# EAGLE design nRF_touch (EAGLE 6.6.0)

## Sheet 1 of 4: MCU
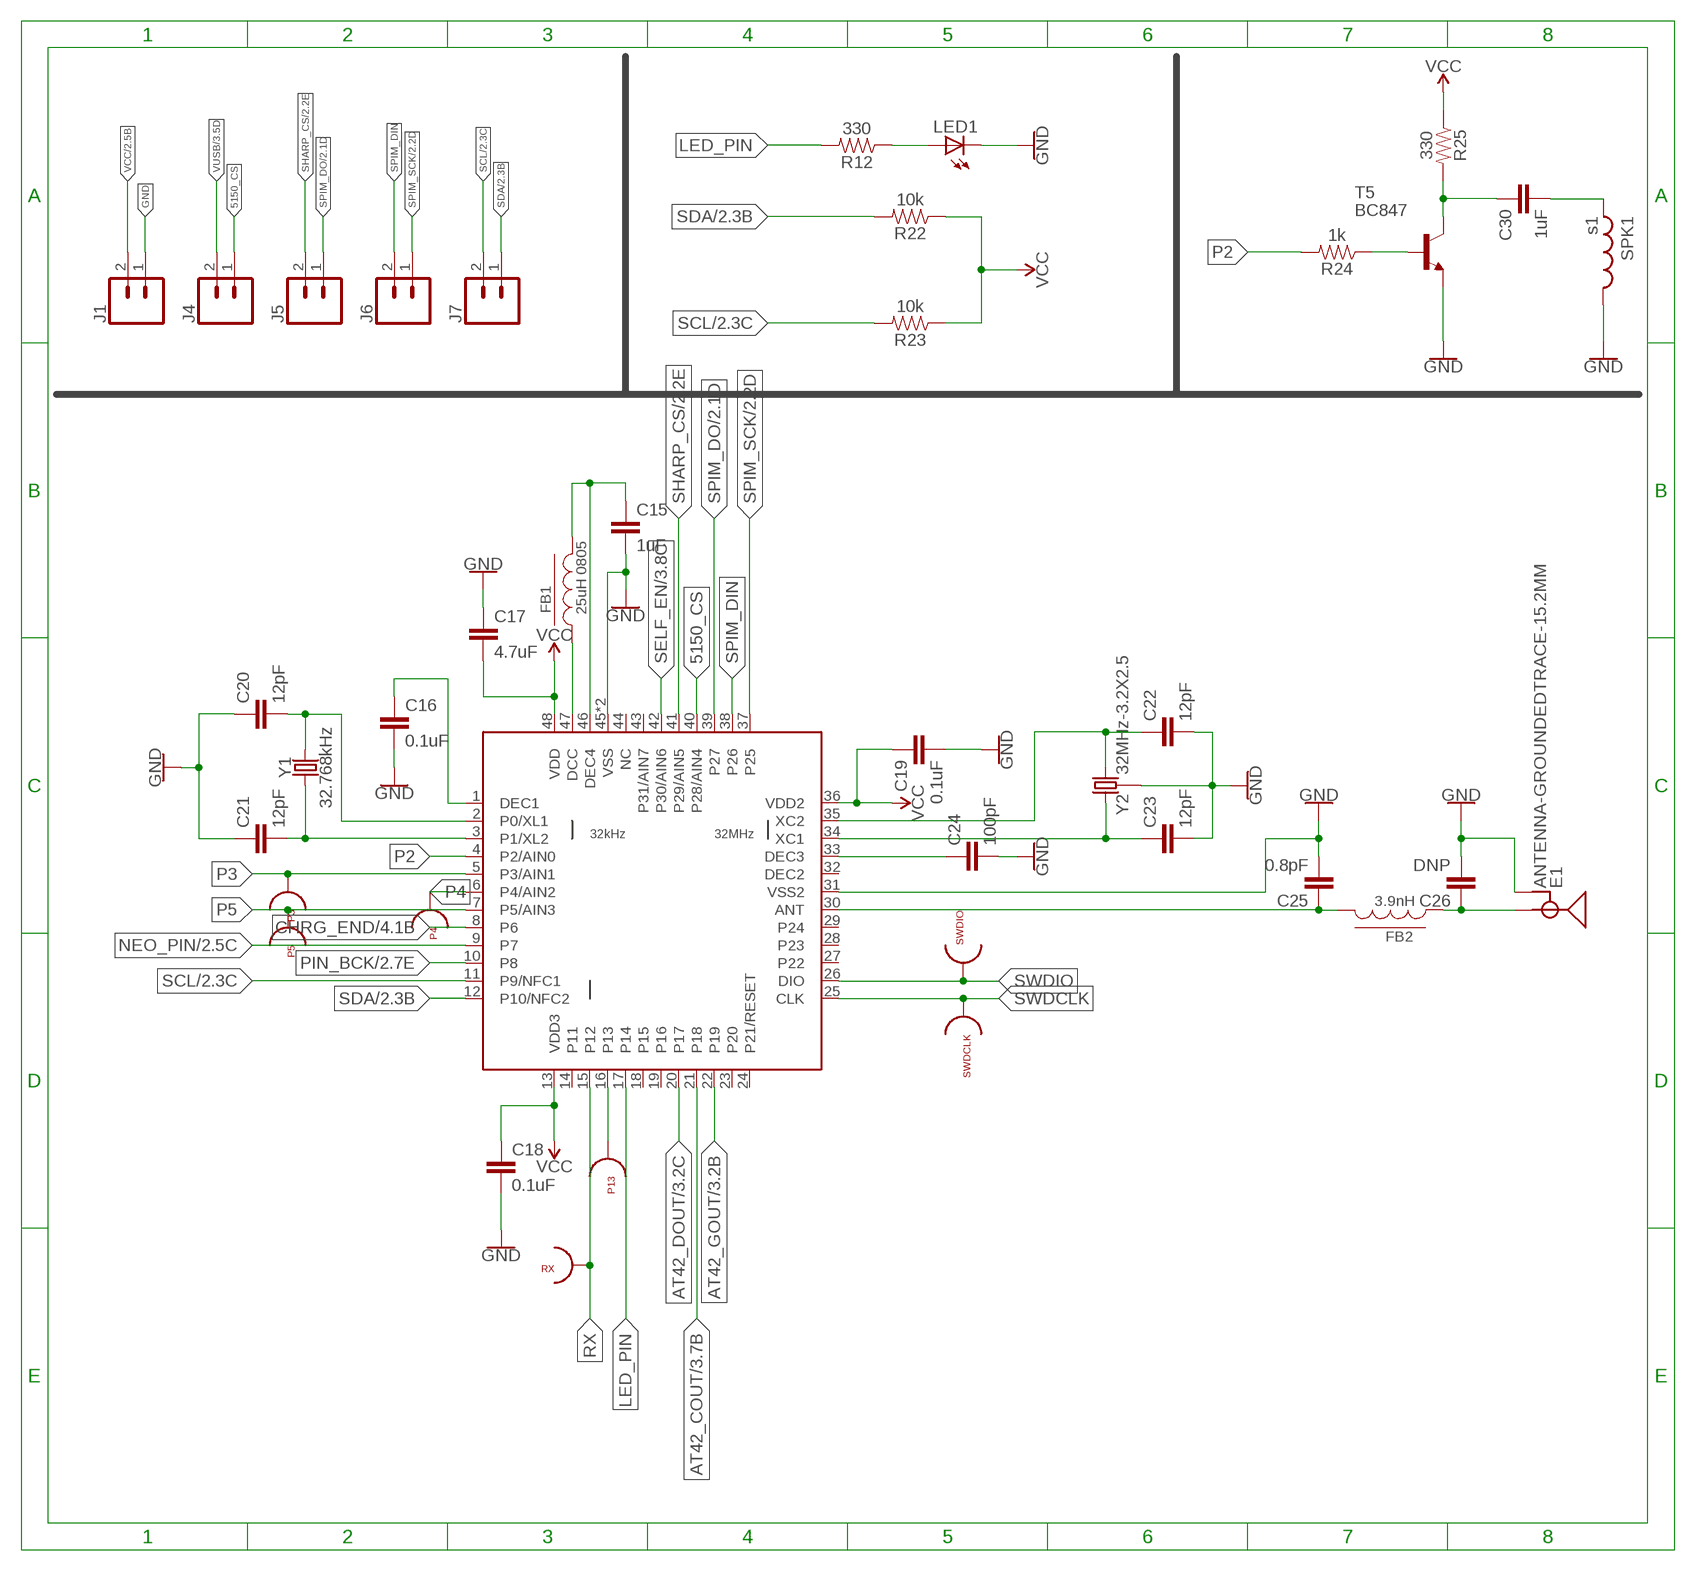
[diagram p0: schematic, sheet 1]

### Parts
C15  1uF  4.7UF0603  [0603]
C16  0.1uF  4.7UF0603  [0603]
C17  4.7uF  4.7UF0603  [0603]
C18  0.1uF  4.7UF0603  [0603]
C19  0.1uF  4.7UF0603  [0603]
C20  12pF  4.7UF0603  [0603]
C21  12pF  4.7UF0603  [0603]
C22  12pF  4.7UF0603  [0603]
C23  12pF  4.7UF0603  [0603]
C24  100pF  4.7UF0603  [0603]
C25  0.8pF  4.7UF0603  [0603]
C26  DNP  4.7UF0603  [0603]
C30  1uF  4.7UF0603  [0603]
E1  ANTENNA-GROUNDEDTRACE-15.2MM  [TRACE_ANTENNA_2.4GHZ_15.2MM]
FB1  25uH 0805  FB_0805  [L0805]
FB2  3.9nH  FB_0805  [L0805]
J1  CONN_02  [1X02]
J4  CONN_02  [1X02]
J5  CONN_02  [1X02]
J6  CONN_02  [1X02]
J7  CONN_02  [1X02]
LED1  LEDCHIPLED_1206  [CHIPLED_1206]
P3  p3  TESTPOINT_22  [TESTPOINT_22]
P4  TESTPOINT_22  [TESTPOINT_22]
P5  TESTPOINT_22  [TESTPOINT_22]
P13  TESTPOINT_22  [TESTPOINT_22]
R12  330  4.7KOHM-0603-1/10W-1%  [0603]
R22  10k  4.7KOHM-0603-1/10W-1%  [0603]
R23  10k  4.7KOHM-0603-1/10W-1%  [0603]
R24  1k  4.7KOHM-0603-1/10W-1%  [0603]
R25  330  4.7KOHM-0603-1/10W-1%  [0603]
RX  TESTPOINT_22  [TESTPOINT_22]
SPK1  s1  MDMK2020T4R7MM  [IND-2020]
SWDCLK  TESTPOINT_22  [TESTPOINT_22]
SWDIO  TESTPOINT_22  [TESTPOINT_22]
T5  BC847  [SOT23]
U$6  NRF52832NRF52832-QFAA  [QFN48]
Y1  32.768kHz  CRYSTAL-32.768KHZSMD-3.2X1.5  [CRYSTAL-SMD-3.2X1.5MM]
Y2  32MHz-3.2X2.5  CRYSTAL-GROUNDEDSMD-5X3.2  [CRYSTAL-SMD-5X3.2-4PAD]

### Nets
5150_CS: J4.1 U$6.40(P28/AIN4)
AT42_COUT: U$6.21(P18) ; also sheet 3
AT42_DOUT [touch]: U$6.20(P17) ; also sheet 3
AT42_GOUT [touch]: U$6.22(P19) ; also sheet 3
CHRG_END: U$6.8(P6) ; also sheet 4
GND [power]: C15.2 C16.2 C17.1 C18.2 C19.2 C20.1 C21.1 C22.2 C23.2 C24.2 C25.2 C26.2 E1.GND J1.1 LED1.C SPK1.P$2 T5.2(E) U$6.31(VSS2) U$6.45(VSS) U$6.GND(VSS) Y2.2 Y2.4 ; also sheet 2,3,4
LED_PIN: R12.2 U$6.17(P14)
N$2 [power]: LED1.A R12.1
N$10: C30.1 R25.2 T5.3(C)
N$15: C24.1 U$6.33(DEC3)
N$17: C15.1 FB1.2 U$6.46(DEC4)
N$18: C25.1 FB2.2 U$6.30(ANT)
N$19: FB1.1 U$6.47(DCC)
N$20: C16.1 U$6.1(DEC1)
N$21: C26.1 E1.ANT(SIGNAL) FB2.1
N$24: C20.2 U$6.2(P0/XL1) Y1.P$2
N$25: C21.2 U$6.3(P1/XL2) Y1.P$1
N$27: C22.1 U$6.35(XC2) Y2.1
N$28: C23.1 U$6.34(XC1) Y2.3
N$29: C30.2 SPK1.P$1
N$30: R24.1 T5.1(B)
NEO_PIN: U$6.9(P7) ; also sheet 2
P2: R24.2 U$6.4(P2/AIN0)
P3: P3.P$1 U$6.5(P3/AIN1)
P4: P4.P$1 U$6.6(P4/AIN2)
P5: P5.P$1 U$6.7(P5/AIN3)
P13: P13.P$1 U$6.16(P13)
PIN_BCK: U$6.10(P8) ; also sheet 2
RX: RX.P$1 U$6.15(P12)
SCL: J7.2 R23.2 U$6.11(P9/NFC1) ; also sheet 2,4
SDA: J7.1 R22.2 U$6.12(P10/NFC2) ; also sheet 2,4
SELF_EN: U$6.42(P30/AIN6) ; also sheet 3
SHARP_CS: J5.2 U$6.41(P29/AIN5) ; also sheet 2
SPIM_DIN: J6.2 U$6.38(P26)
SPIM_DO: J5.1 U$6.39(P27) ; also sheet 2
SPIM_SCK: J6.1 U$6.37(P25) ; also sheet 2
SWDCLK: SWDCLK.P$1 U$6.25(CLK)
SWDIO: SWDIO.P$1 U$6.26(DIO)
VCC [power]: C17.2 C18.1 C19.1 J1.2 R22.1 R23.1 R25.1 U$6.13(VDD3) U$6.36(VDD2) U$6.48(VDD) ; also sheet 2,3,4
VUSB [power]: J4.2 ; also sheet 3,4
Unconnected: U$6.14(P11) U$6.18(P15) U$6.19(P16) U$6.23(P20) U$6.24(P21/RESET) U$6.27(P22) U$6.28(P23) U$6.29(P24) U$6.32(DEC2) U$6.43(P31/AIN7) U$6.44(NC)

## Sheet 2 of 4: PERIPH
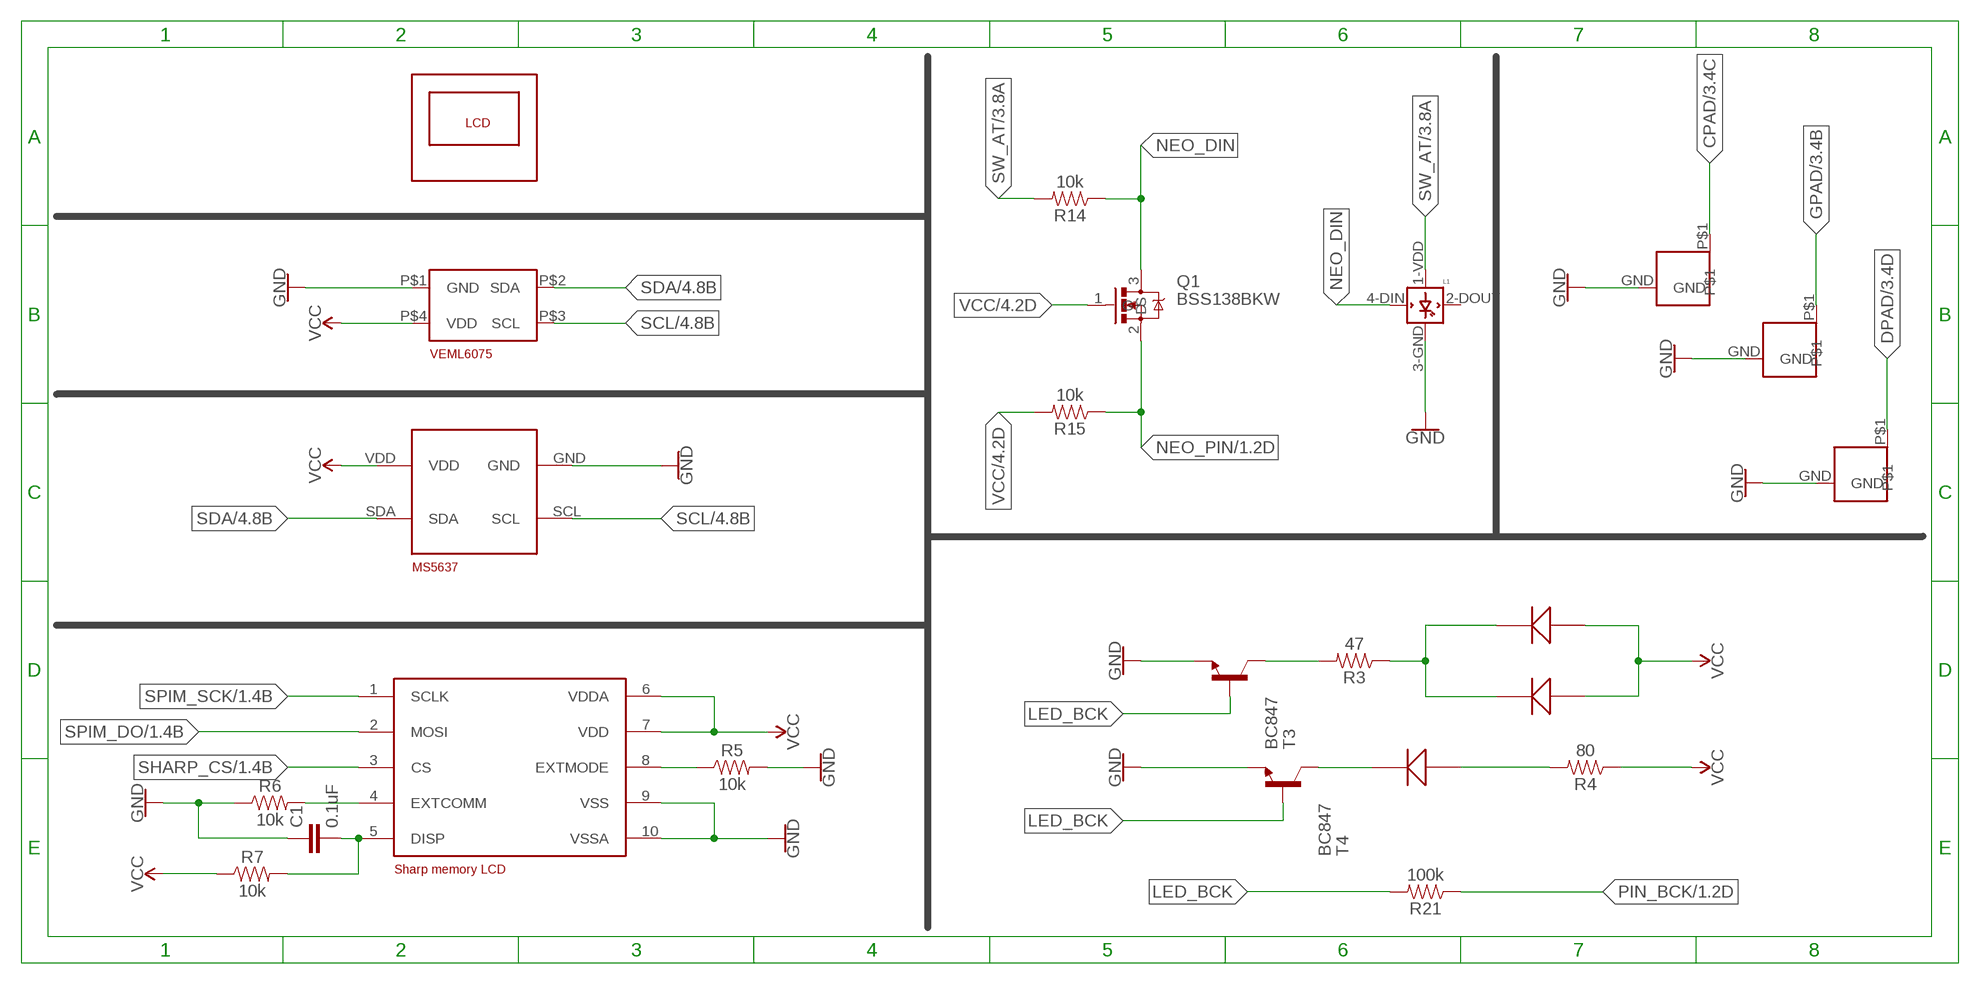
[diagram p1: schematic, sheet 2]

### Parts
C1  0.1uF  0.1UF-0603-25V-(+80/-20%)  [0603]
L1  WS2812B  [WS2812B]
MS5637  MS5637  [MS5637]
Q1  BSS138BKW  [SOT65P210X110-3N]
R3  47  4.7KOHM-0603-1/10W-1%  [0603]
R4  80  4.7KOHM-0603-1/10W-1%  [0603]
R5  10k  4.7KOHM-0603-1/10W-1%  [0603]
R6  10k  4.7KOHM-0603-1/10W-1%  [0603]
R7  10k  4.7KOHM-0603-1/10W-1%  [0603]
R14  10k  4.7KOHM-0603-1/10W-1%  [0603]
R15  10k  4.7KOHM-0603-1/10W-1%  [0603]
R21  100k  4.7KOHM-0603-1/10W-1%  [0603]
S1  L_BUTTON  BUTTON  [BUTTON]
S2  BUTTON  [BUTTON]
S3  L_BUTTON  BUTTON  [BUTTON]
T3  BC847  [SOT23]
T4  BC847  [SOT23]
U$1  KPA-2106SECK  [KPA-2106SECK]
U$2  VEML6075  [VEML6075]
U$4  SHARP27  [SHARP27]
U$5  SHARP27_FOOTPRINT  [LCD27]
U$7  KPA-2106SECK  [KPA-2106SECK]
U$8  KPA-2106SECK  [KPA-2106SECK]

### Nets
CPAD [touch]: S2.P$1 ; also sheet 3
DISP: C1.2 R7.2 U$4.5(DISP)
DPAD [touch]: S1.P$1 ; also sheet 3
EXTCOMM: R6.2 U$4.4(EXTCOMM)
EXTMODE: R5.1 U$4.8(EXTMODE)
GND [power]: C1.1 L1.3-GND(GND) MS5637.GND R5.2 R6.1 S1.GND S2.GND S3.GND T3.2(E) T4.2(E) U$2.P$1(GND) U$4.9(VSS) U$4.10(VSSA) ; also sheet 1,3,4
GPAD [touch]: S3.P$1 ; also sheet 3
LED_BCK: R21.2 T3.1(B) T4.1(B)
N$11: R4.2 U$8.P$2
N$13: R3.1 U$1.P$1 U$7.P$1
N$22: T4.3(C) U$8.P$1
N$23: R3.2 T3.3(C)
NEO_DIN: L1.4-DIN(DIN) Q1.3(D) R14.1
NEO_PIN: Q1.2(S) R15.1 ; also sheet 1
PIN_BCK: R21.1 ; also sheet 1
SCL: MS5637.SCL U$2.P$3(SCL) ; also sheet 1,4
SDA: MS5637.SDA U$2.P$2(SDA) ; also sheet 1,4
SHARP_CS: U$4.3(CS) ; also sheet 1
SPIM_DO: U$4.2(MOSI) ; also sheet 1
SPIM_SCK: U$4.1(SCLK) ; also sheet 1
SW_AT: L1.1-VDD(VDD) R14.2 ; also sheet 3
VCC [power]: MS5637.VDD Q1.1(G) R4.1 R7.1 R15.2 U$1.P$2 U$2.P$4(VDD) U$4.6(VDDA) U$4.7(VDD) U$7.P$2 ; also sheet 1,3,4
Unconnected: L1.2-DOUT(DOUT)

## Sheet 3 of 4: PSwitch
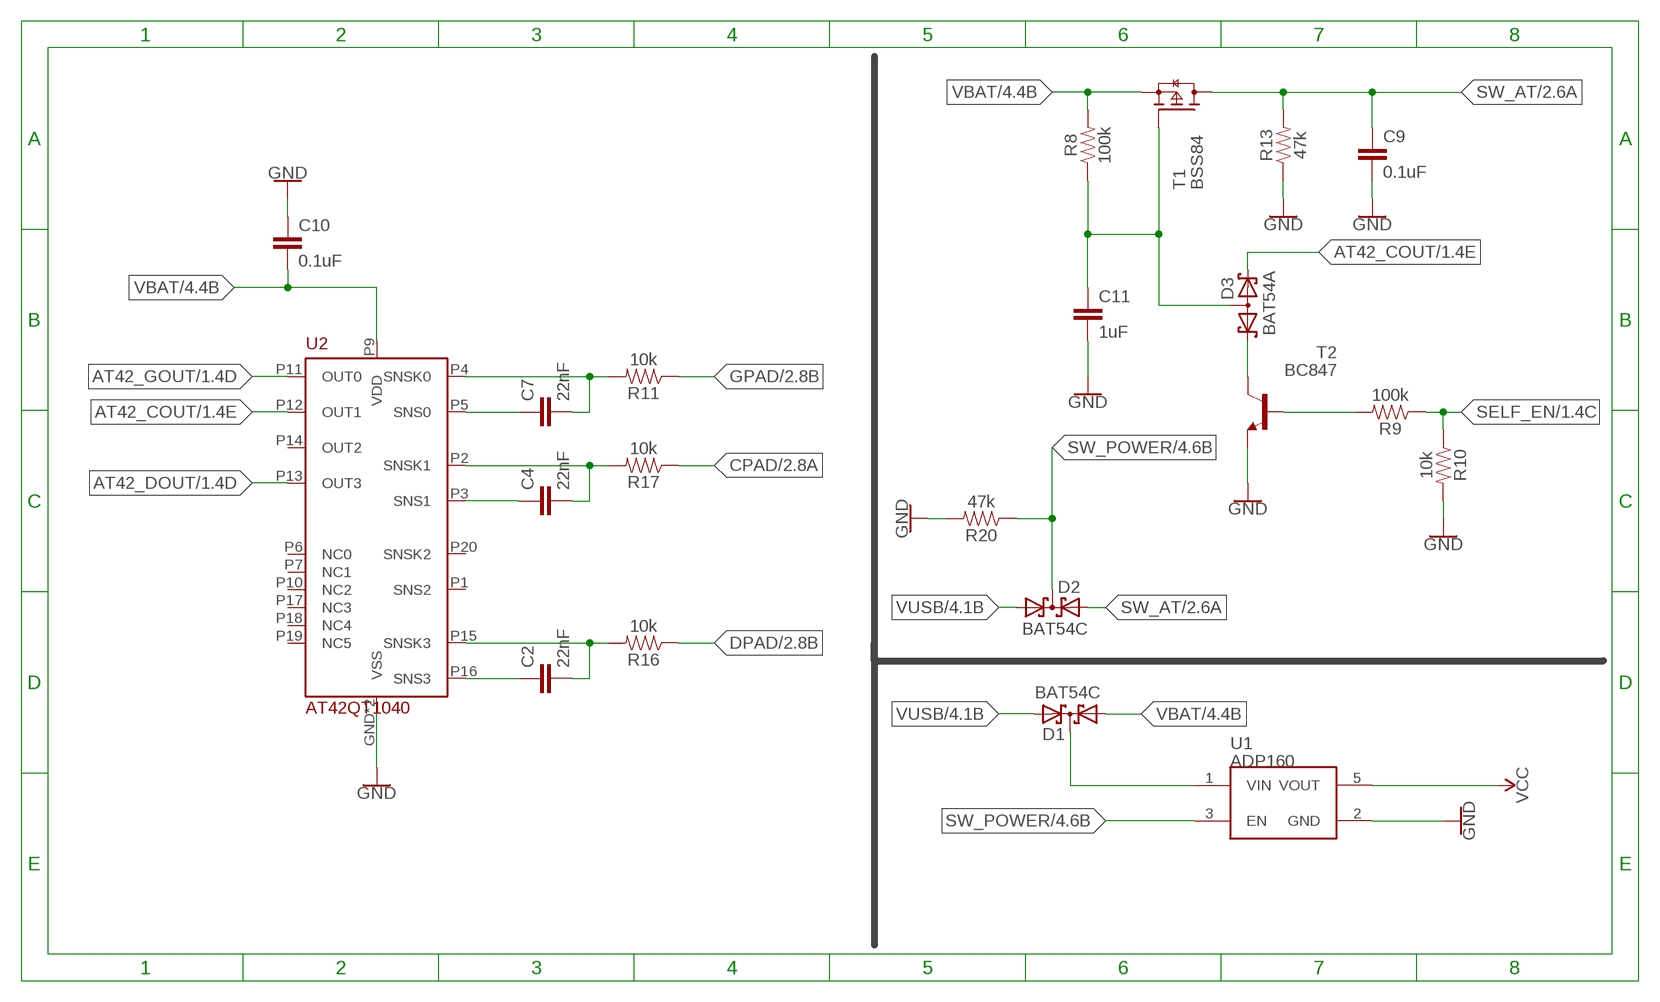
[diagram p2: schematic, sheet 3]

### Parts
C2  22nF  0.1UF-0603-25V-5%  [0603]
C4  22nF  0.1UF-0603-25V-5%  [0603]
C7  22nF  0.1UF-0603-25V-5%  [0603]
C9  0.1uF  0.1UF-0603-25V-5%  [0603]
C10  0.1uF  0.1UF-0603-25V-5%  [0603]
C11  1uF  0.1UF-0603-25V-5%  [0603]
D1  BAT54C  BAT754C  [SOT23]
D2  BAT54C  BAT754C  [SOT23]
D3  BAT54A  BAT754A  [SOT23]
R8  100k  4.7KOHM-0603-1/10W-1%  [0603]
R9  100k  4.7KOHM-0603-1/10W-1%  [0603]
R10  10k  4.7KOHM-0603-1/10W-1%  [0603]
R11  10k  4.7KOHM-0603-1/10W-1%  [0603]
R13  47k  4.7KOHM-0603-1/10W-1%  [0603]
R16  10k  4.7KOHM-0603-1/10W-1%  [0603]
R17  10k  4.7KOHM-0603-1/10W-1%  [0603]
R20  47k  4.7KOHM-0603-1/10W-1%  [0603]
T1  BSS84  [SOT23]
T2  BC847  [SOT23]
U1  ADP160  [SOT23-5]
U2  AT42QT1040  [VQFN20]

### Nets
AT42_COUT: D3.2(K2) U2.P12(OUT1) ; also sheet 1
AT42_DOUT [touch]: U2.P13(OUT3) ; also sheet 1
AT42_GOUT [touch]: U2.P11(OUT0) ; also sheet 1
CPAD [touch]: R17.1 ; also sheet 2
DPAD [touch]: R16.1 ; also sheet 2
GND [power]: C9.2 C10.1 C11.2 R10.2 R13.1 R20.2 T2.2(E) U1.2(GND) U2.GND(VSS) U2.P8(VSS) ; also sheet 1,2,4
GPAD [touch]: R11.1 ; also sheet 2
LDO_VIN [power]: D1.3(K1K2) U1.1(VIN)
N$1: R9.2 T2.1(B)
N$3: C2.2 R16.2 U2.P15(SNSK3)
N$4: C2.1 U2.P16(SNS3)
N$5: C4.2 R17.2 U2.P2(SNSK1)
N$6: C7.2 R11.2 U2.P4(SNSK0)
N$7: C7.1 U2.P5(SNS0)
N$8: C11.1 D3.3(A1A2) R8.1 T1.1(G)
N$9: C4.1 U2.P3(SNS1)
SELF_EN: R9.1 R10.1 ; also sheet 1
SW_AT: C9.1 D2.2(A2) R13.2 T1.3(D) ; also sheet 2
SW_POWER: D2.3(K1K2) R20.1 U1.3(EN) ; also sheet 4
TRANS: D3.1(K1) T2.3(C)
VBAT [power]: C10.2 D1.1(A1) R8.2 T1.2(S) U2.P9(VDD) ; also sheet 4
VCC [power]: U1.5(VOUT) ; also sheet 1,2,4
VUSB [power]: D1.2(A2) D2.1(A1) ; also sheet 1,4
Unconnected: U2.P1(SNS2) U2.P6(NC0) U2.P7(NC1) U2.P10(NC2) U2.P14(OUT2) U2.P17(NC3) U2.P18(NC4) U2.P19(NC5) U2.P20(SNSK2)

## Sheet 4 of 4: Power
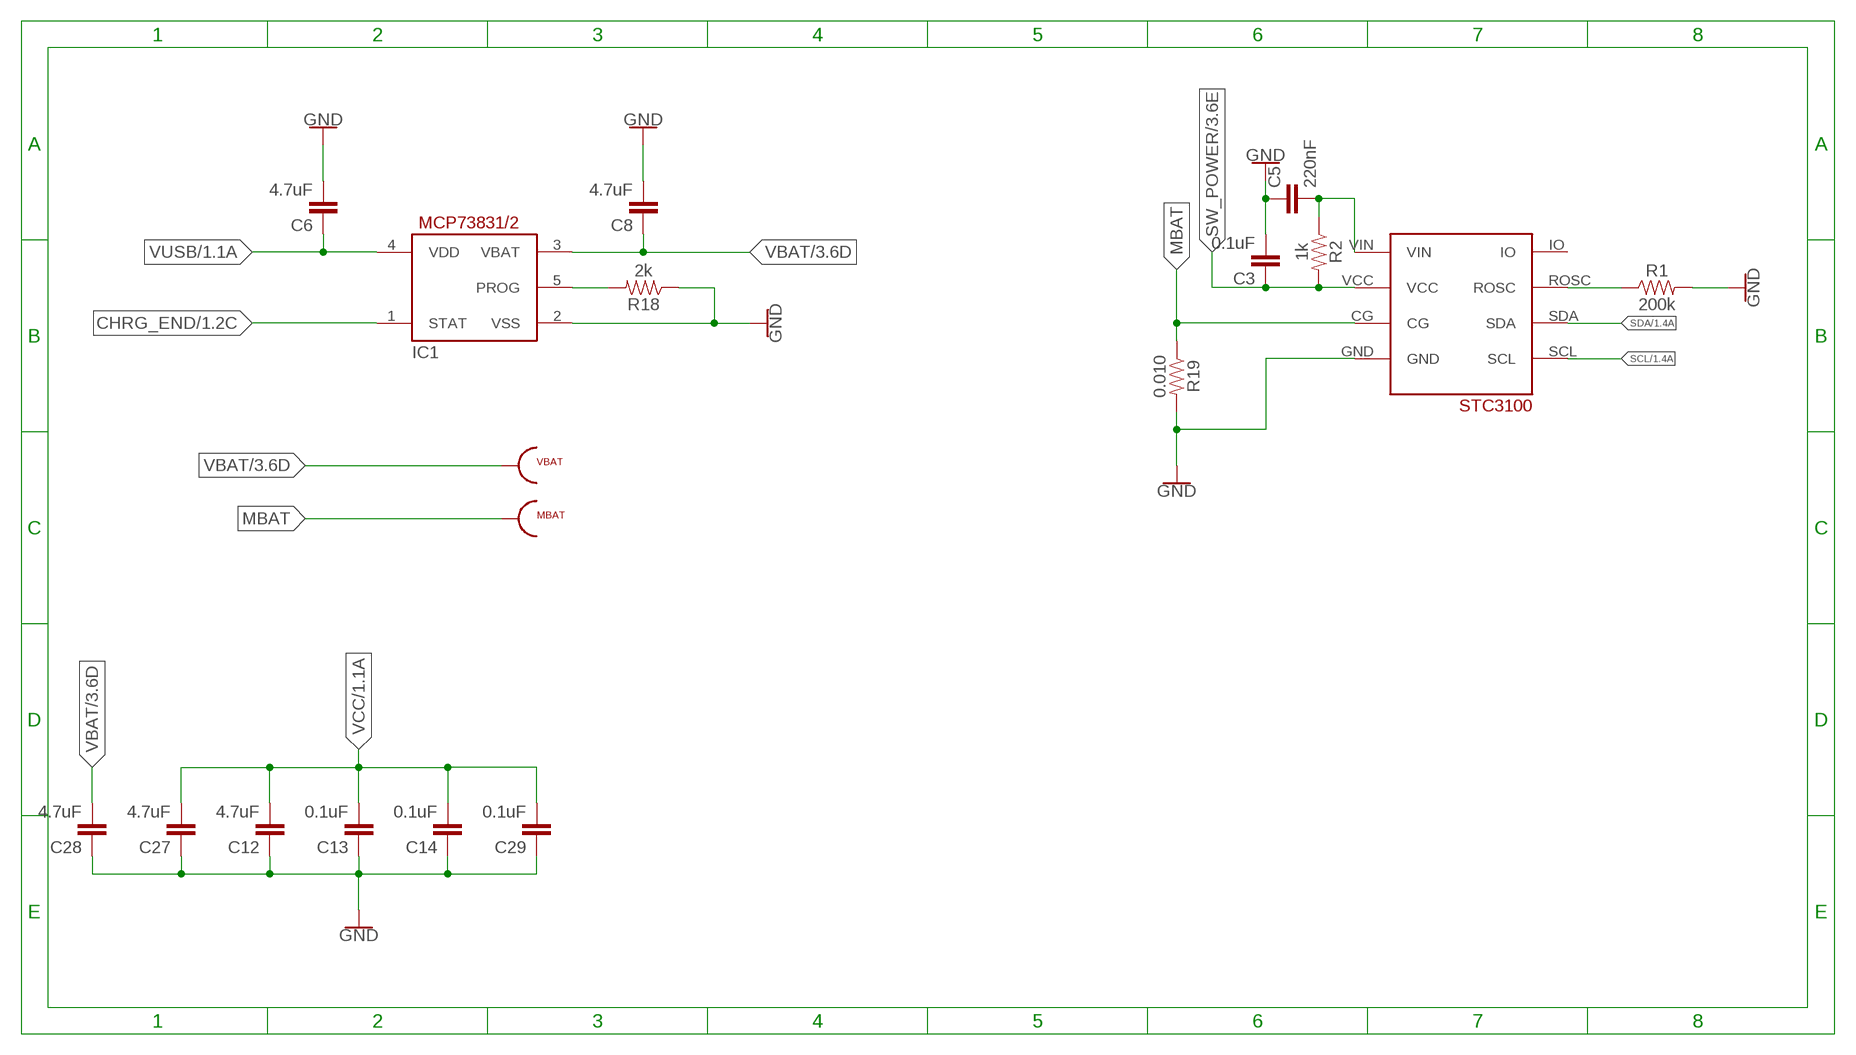
[diagram p3: schematic, sheet 4]

### Parts
C3  0.1uF  0.1UF-0603-25V-(+80/-20%)  [0603]
C5  220nF  0.1UF-0603-25V-(+80/-20%)  [0603]
C6  4.7uF  0.1UF-0603-25V-(+80/-20%)  [0603]
C8  4.7uF  0.1UF-0603-25V-(+80/-20%)  [0603]
C12  4.7uF  0.1UF-0603-25V-(+80/-20%)  [0603]
C13  0.1uF  0.1UF-0603-25V-(+80/-20%)  [0603]
C14  0.1uF  0.1UF-0603-25V-(+80/-20%)  [0603]
C27  4.7uF  0.1UF-0603-25V-(+80/-20%)  [0603]
C28  4.7uF  0.1UF-0603-25V-(+80/-20%)  [0603]
C29  0.1uF  0.1UF-0603-25V-(+80/-20%)  [0603]
IC1  MCP73831/OT  [SOT23-5L]
MBAT  TESTPOINT_22  [TESTPOINT_22]
R1  200k  4.7KOHM-0603-1/10W-1%  [0603]
R2  1k  4.7KOHM-0603-1/10W-1%  [0603]
R18  2k  4.7KOHM-0603-1/10W-1%  [0603]
R19  0.010  4.7KOHM-0603-1/10W-1%  [0603]
U$3  STC3100  [STC3100]
VBAT  TESTPOINT_22  [TESTPOINT_22]

### Nets
CHRG_END: IC1.1(STAT) ; also sheet 1
GND [power]: C3.2 C5.1 C6.2 C8.2 C12.1 C13.1 C14.1 C27.1 C28.1 C29.1 IC1.2(VSS) R1.2 R18.1 R19.2 U$3.GND ; also sheet 1,2,3
MBAT: MBAT.P$1 R19.1 U$3.CG
N$12: C5.2 R2.1 U$3.VIN
N$14: IC1.5(PROG) R18.2
N$16: R1.1 U$3.ROSC
SCL: U$3.SCL ; also sheet 1,2
SDA: U$3.SDA ; also sheet 1,2
SW_POWER: C3.1 R2.2 U$3.VCC ; also sheet 3
VBAT [power]: C8.1 C28.2 IC1.3(VBAT) VBAT.P$1 ; also sheet 3
VCC [power]: C12.2 C13.2 C14.2 C27.2 C29.2 ; also sheet 1,2,3
VUSB [power]: C6.1 IC1.4(VDD) ; also sheet 1,3
Unconnected: U$3.IO

## Library data of the parts
C1 C3 C13 C14 C29 = SparkFun-Capacitors:0.1UF: 0.1µF ceramic capacitors A capacitor is a passive two-terminal electrical component used to store electrical energy temporarily in an electric field.; PROD_ID: CAP-00810
C2 C4 C7 C11 = SparkFun-Capacitors:0.1UF: 0.1µF ceramic capacitors A capacitor is a passive two-terminal electrical component used to store electrical energy temporarily in an electric field.; PROD_ID: CAP-08604; VALUE: 0.1uF
C5 C6 C8 C12 C27 C28 = SparkFun-Capacitors:0.1UF: 0.1µF ceramic capacitors A capacitor is a passive two-terminal electrical component used to store electrical energy temporarily in an electric field.; PROD_ID: CAP-00810; VALUE: 0.1uF
C9 C10 = SparkFun-Capacitors:0.1UF: 0.1µF ceramic capacitors A capacitor is a passive two-terminal electrical component used to store electrical energy temporarily in an electric field.; PROD_ID: CAP-08604
C15 C16 C18-C26 C30 = SparkFun-Capacitors:4.7UF: 4.7µF ceramic capacitors A capacitor is a passive two-terminal electrical component used to store electrical energy temporarily in an electric field.; PROD_ID: CAP-08280; VALUE: 4.7uF
C17 = SparkFun-Capacitors:4.7UF: 4.7µF ceramic capacitors A capacitor is a passive two-terminal electrical component used to store electrical energy temporarily in an electric field.; PROD_ID: CAP-08280
D1 D2 = nxp_60:BAT754C: Schottky barrier (double) diodes Planar Schottky barrier diodes encapsulated in a SOT23 small plastic SMD package. Low forward voltage selection of the BAT54 series. Single diodes and double diodes with different pinning are available. AAL Eindhoven MK
D3 = nxp_60:BAT754A: Schottky barrier (double) diodes Planar Schottky barrier diodes encapsulated in a SOT23 small plastic SMD package. Low forward voltage selection of the BAT54 series. Single diodes and double diodes with different pinning are available. AAL Eindhoven MK
E1 = SparkFun-RF:ANTENNA-GROUNDED: Antenna w/ Ground Connection 2.4GHz antennae with signal and ground terminals. TRACE_ANTENNA_2.4GHZ_15.2MM - Meander Trace antenna 15.2 x 5.7mm footprint Based on layout from TI app note AN043 <http://www.ti.com/lit/an/swra117d/swra117d.pdf>. TRACE_ANTENNA_2.4GHZ_25.7MM - Inverted F trace antenna 25.7 x 7.5 mm footprint. Based on layout from TI design note DN0007 <http://www.ti.com/lit/an/swru120b/swru120b.pdf>.
FB1 FB2 = ferrite_beads:FB_0805
IC1 = adafruit:MCP73831: MCP73831/2 Miniature Single-Cell, Fully Integrated Li-Ion, Li-Polymer Charge Management Controllers. Nice and small simple lipoly charge controller, with adjustable current and status output (LED) http://www.ladyada.net/library/pcb/eaglelibrary.html
J1 J4-J7 = SparkFun-Connectors:CONN_02: Multi connection point. Often used as Generic Header-pin footprint for 0.1 inch spaced/style header connections On any of the 0.1 inch spaced packages, you can populate with these: Break Away Headers - Straight <https://www.sparkfun.com/products/116> (PRT-00116) Break Away Male Headers - Right Angle <https://www.sparkfun.com/products/553> (PRT-00553) Female Headers <https://www.sparkfun.com/products/115> (PRT-00115) Break Away Headers - Machine Pin <https://www.sparkfun.com/products/117> (PRT-00117) Break Away Female Headers - Swiss Machine Pin <https://www.sparkfun.com/products/743> (PRT-00743) For SCREWTERMINALS and SPRING TERMINALS visit here: Screw Terimnals on SparkFun.com <https://www.sparkfun.com/search/results?term=Screw+Terminals> (5mm/3.5mm/2.54mm spacing) This device is also useful as a general connection point to wire up your design to another part of your project. Our various solder wires solder well into these plated through hole pads. Hook-Up Wire - Assortment (Stranded, 22 AWG) <https://www.sparkfun.com/products/11375> (PRT-11375) Hook-Up Wire - Assortment (Solid Core, 22 AWG) <https://www.sparkfun.com/products/11367> (PRT-11367) View the entire wire category on our website here <https://www.sparkfun.com/categories/141> Special notes: Molex polarized connector foot print use with: PRT-08233 with associated crimp pins and housings. 2.54_SCREWTERM for use with PRT-10571. 3.5mm Screw Terminal footprints for PRT-08084 5mm Screw Terminal footprints for use with PRT-08432
L1 = adafruit:WS2812B
LED1 = adafruit:LED: LED OSRAM: - CHIPLED LG R971, LG N971, LY N971, LG Q971, LY Q971, LO R971, LY R971 LH N974, LH R974 LS Q976, LO Q976, LY Q976 LO Q996 - Hyper CHIPLED LW Q18S LB Q993, LB Q99A, LB R99A - SideLED LS A670, LO A670, LY A670, LG A670, LP A670 LB A673, LV A673, LT A673, LW A673 LH A674 LY A675 LS A676, LA A676, LO A676, LY A676, LW A676 LS A679, LY A679, LG A679 - Hyper Micro SIDELED® LS Y876, LA Y876, LO Y876, LY Y876 LT Y87S - SmartLED LW L88C, LW L88S LB L89C, LB L89S, LG L890 LS L89K, LO L89K, LY L89K LS L896, LA L896, LO L896, LY L896 - TOPLED LS T670, LO T670, LY T670, LG T670, LP T670 LSG T670, LSP T670, LSY T670, LOP T670, LYG T670 LG T671, LOG T671, LSG T671 LB T673, LV T673, LT T673, LW T673 LH T674 LS T676, LA T676, LO T676, LY T676, LB T676, LH T676, LSB T676, LW T676 LB T67C, LV T67C, LT T67C, LS T67K, LO T67K, LY T67K, LW E67C LS E67B, LA E67B, LO E67B, LY E67B, LB E67C, LV E67C, LT E67C LW T67C LS T679, LY T679, LG T679 LS T770, LO T770, LY T770, LG T770, LP T770 LB T773, LV T773, LT T773, LW T773 LH T774 LS E675, LA E675, LY E675, LS T675 LS T776, LA T776, LO T776, LY T776, LB T776 LHGB T686 LT T68C, LB T68C - Hyper Mini TOPLED® LB M676 - Mini TOPLED Santana® LG M470 LS M47K, LO M47K, LY M47K Source: http://www.osram.convergy.de/
MBAT P3-P5 P13 RX SWDCLK SWDIO VBAT = test_points:TESTPOINT_22
MS5637 = MS5637:MS5637: Le MS563702BA03-50 est un Micro Altimètre ultra compact optimisé pour des applications d'altimètre et de baromètre dans des téléphones portables et des tablettes. La résolution d'altitude au niveau de la mer est de 13cm d'air. Le module de capteur comprend un capteur de pression haute linéarité et un CAN ΔΣ 24 bits ultra faible puissance avec des coefficients internes calibrés en usine. Il fournit une valeur numérique de pression et de température précise de 24 bits et différents modes de fonctionnement qui permettent à l'utilisateur d'optimiser la vitesse de conversion et la consommation de courant. La sortie de température à haute résolution permet la mise en œuvre d'une fonction altimètre / thermomètre sans capteur supplémentaire. Il peut être interfacé avec pratiquement tous les microcontrôleurs à interface I²C-bus. Le protocole de communication est simple, sans avoir à programmer des registres internes dans l'appareil. Faibles dimensions de 3 x 3 x 0.9mm³ pour une intégratio Module haute résolution, 13cm Capteur de pression numérique intégré (CAN ΔΣ 24 bits) Interface I²C Plage de pression étendue de 10 à 2000mbar Conversion rapide jusqu'à 0.5ms Faible consommation, 0.6µA (veille <=0.1µA à 25°C) Aucun composant externe (oscillateur interne)
Q1 = BSS138:BSS138BKW: N-channel Trench MOSFET; MPN: BSS138BKW; OC_FARNELL: 2053836; OC_NEWARK: 61T7488; PACKAGE: SOT-23-3; SUPPLIER: NXP
R1-R25 = SparkFun-Resistors:4.7KOHM: 4.7kΩ resistor A resistor is a passive two-terminal electrical component that implements electrical resistance as a circuit element. Resistors act to reduce current flow, and, at the same time, act to lower voltage levels within circuits. - Wikipedia; PROD_ID: RES-07857; VALUE: 4.7k
S1-S3 = qtouch:BUTTON
SPK1 = Strutz Electronic Industries:MDMK2020T4R7MM
T1 = nxp_60:BSS84: P-channel enhancement mode vertical DMOS transistor P-channel enhancement mode vertical Diffusion Metal-Oxide Semiconductor (DMOS) transistor in a small Surface-Mounted Device (SMD) plastic package. AAL Eindhoven MK
T2-T5 = nxp_60:BC847: 45 V, 100 mA NPN general-purpose transistors NPN general-purpose transistor AAL Eindhoven MK
U1 = SparkFun-IC-Power:ADP160: Nanopower LDO Iq less than 1uA for low Iload; PROD_ID: VREG-11306
U2 = AT42QT1040:AT42QT1040: Four-key QTouch® Touch Sensor IC
U$1 U$7 U$8 = KPA_LED:KPA-2106SECK: LED, Angle Droit, Orange, CMS, 20 mA, 2.1 V, 601 nm
U$2 = VEML6075:VEML6075: The VEML6075 senses UVA and UVB light and incorporates photodiode, amplifiers, and analog / digital circuits into a single chip using a CMOS process. When the UV sensor is applied, it is able to detect UVA and UVB intensity to provide a measure of the signal strength as well as allowing for UVI measurement.
U$3 = STC3100:STC3100: The STC3100 monitors the critical parameters of a single-cell Li-Ion battery (voltage, temperature and current) and includes hardware functions to implement a gas gauge for battery charge monitoring, based on a programmable 12- to 14-bit A/D converter. With a typical 30 milliOhms external sense resistor, the battery current can be up to 2.5 A and the accumulator system provides a capacity up to +/-7000 mAh with a resolution of 0.2 mAh. The device is programmable through the I2C interface.
U$4 = sharp:SHARP27: Sharp memory LCD LS027B7DH01
U$5 = sharp:SHARP27_FOOTPRINT
U$6 = NRF52832:NRF52832: Bluetooth 4.0 Low Energy/2.4Ghz NORDIC SEMICONDUCTOR
Y1 = SparkFun-Clocks:CRYSTAL-32.768KHZ: 32.768kHz Crystal Frequency: 32.768kHz Frequency Stability: ±20ppm Load Capacitance: 12.5pF (PTH-2X6 & SMD-3.2X1.5), 6pF (SMD-2X6) SparkFun Products: SparkFun BigTime Watch Kit <https://www.sparkfun.com/products/11734> SparkFun nRF52832 Breakout <https://www.sparkfun.com/products/13990> SparkFun Real Time Clock Module <https://www.sparkfun.com/products/12708>; PROD_ID: XTAL-13062
Y2 = SparkFun-Clocks:CRYSTAL-GROUNDED: Crystals w/ Ground Pin (Generic) These are passive quartz crystals, which can be used as a clock source for a microcontroller. Crystal's are usually two-terminal devices. A third terminal may be optionally connected to ground, as recommended by the manufaturer.

## Net classes
0 default: width 0.152 mm, drill 0.254 mm, clearance 0.178 mm
1 power: width 0.229 mm, drill 0.254 mm, clearance 0.254 mm
2 touch: width 0.152 mm, drill 0.254 mm, clearance 0.356 mm

## Board
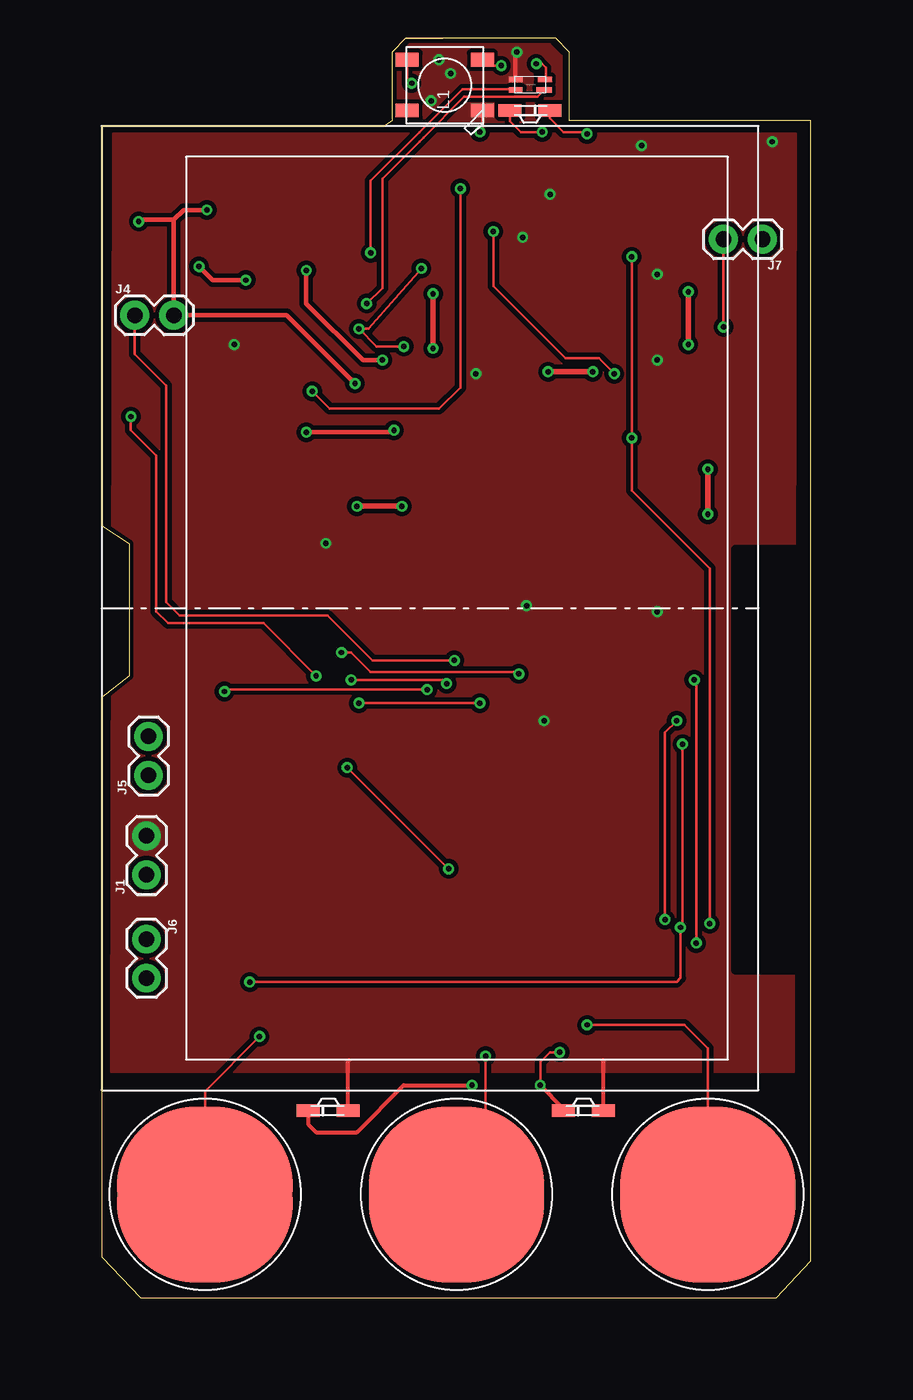
[diagram p4: board, top side]
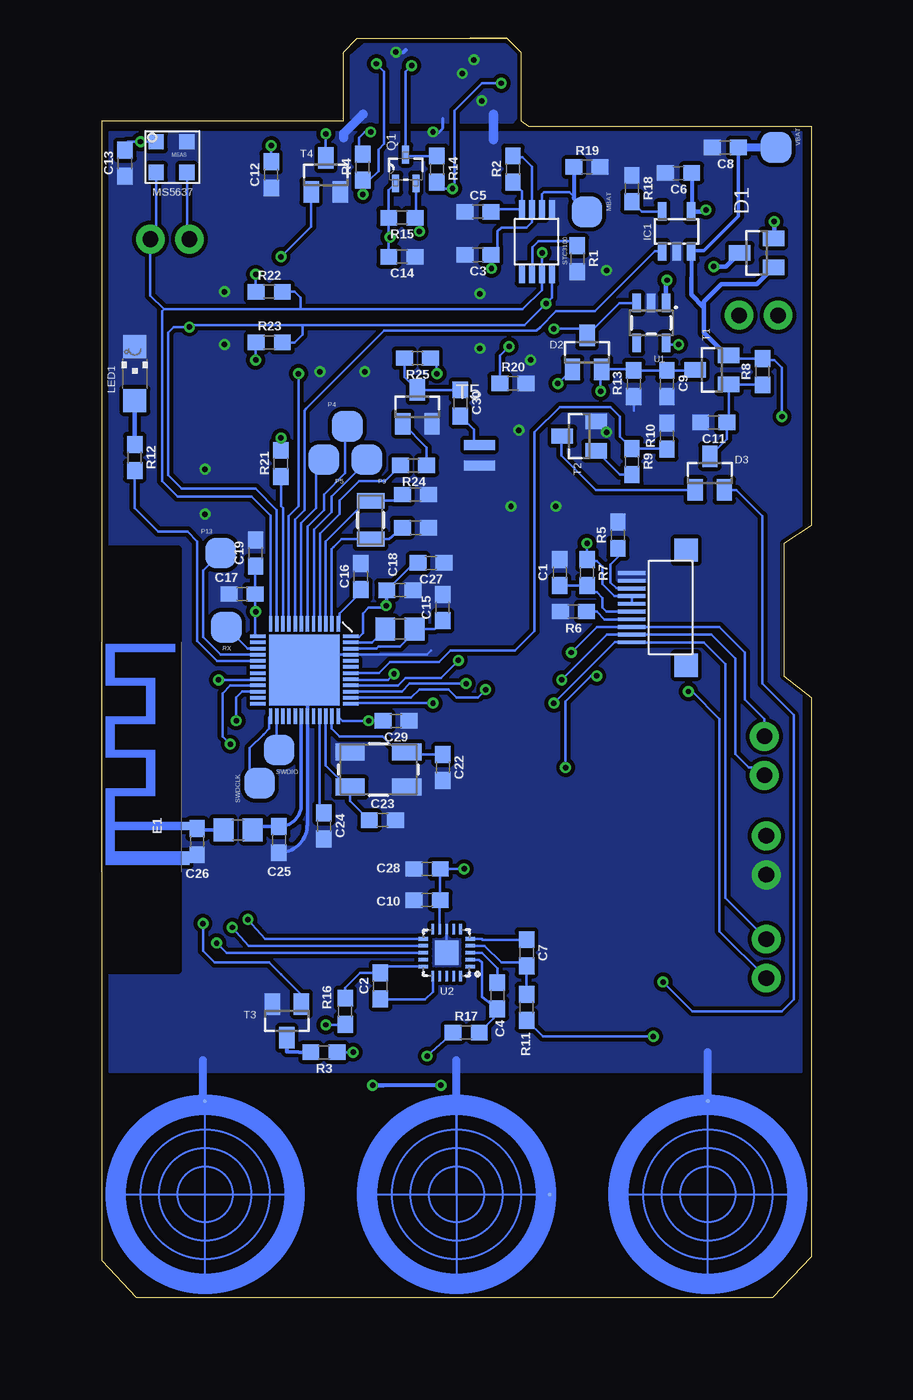
[diagram p5: board, bottom side, seen from below]

Size 46.2 x 82.04 mm. Coordinates in mm from the lower left corner, seen from the top.
Outline: 22.23,82.04 29.59,82.04 30.48,81.15 30.48,76.68 46.2,76.68 46.2,2.41 43.94,0 43.61,0 3.3,0 2.54,0 0,2.67 0,39.12 1.78,40.51 1.78,49.15 0,50.29 0,76.32 18.41,76.32 18.92,76.68 18.92,81.15 19.81,82.04
Outline: 22.23,82.04 19.81,82.04
Outline: 19.81,82.04 22.23,82.04
Outline: 22.23,82.04 19.81,82.04
Copper layers (1*16): Top 0.0356mm / dielectric 1.5011mm / Bottom 0.0356mm
Design rules "oshpark-2layer *": minimum track width 6mil, minimum drill 13mil, track to track 6mil, track to pad 6mil, pad to pad 6mil, via to via 6mil, smd to smd 6mil, copper to edge 10mil, drill to drill 6mil, minimum pad ring 7mil, minimum via ring 7mil, stop-mask expansion 2.5mil, vias tented up to drill 0mil, thermal gap 10mil
tRestrict: area 41.3,21.3 to 47.4,48.8
bRestrict: area 41.3,21.3 to 47.4,48.8

### Footprints (pad centres in the part's own frame; a part is rotated, then mirrored left to right if it is on the bottom)
0603 = smd 1.1 x 1: 1 -0.85,0; 2 0.85,0
SOT23 = smd 1 x 1.4: 1 -0.95,-1.1; 2 0.95,-1.1; 3 0,1.1
TRACE_ANTENNA_2.4GHZ_15.2MM = smd 0.5 x 0.5: ANT 0,-0.25 | smd 0.9 x 0.5: GND -2.1,-0.25
L0805 = smd 1.3 x 1.5: 1 -0.95,0; 2 0.95,0
SOT23-5L = smd 0.55 x 1.2: 1 -0.95,-1.3; 2 0,-1.3; 3 0.95,-1.3; 4 0.95,1.3; 5 -0.95,1.3
1X02 = drill 1.016 pad 1.88: 1 0,0; 2 2.54,0
WS2812B = smd 1.5 x 0.9: 1-VDD 2.45,-1.65; 2-DOUT 2.45,1.65; 3-GND -2.45,1.65; 4-DIN -2.45,-1.65
CHIPLED_1206 = smd 1.5 x 1.5: A 0,-1.75; C 0,1.75
TESTPOINT_22 = smd 2 x 2: P$1 0,0
MS5637 = smd 1 x 1: GND 1,1; SCL 1,-1; SDA -1,-1; VDD -1,1
SOT65P210X110-3N = smd 1.168 x 0.457: 1 -0.94,0.66; 2 -0.94,-0.66; 3 0.94,0
BUTTON = smd 0.254 x 0.254 bottom: GND 0,6.088 | smd 11.43 x 11.43: P$1 0,0
IND-2020 = smd 0.65 x 2: P$1 0.325,1; P$2 1.675,1
SOT23-5 = smd 0.55 x 1.2: 1 -0.95,-1.3; 2 0,-1.3; 3 0.95,-1.3; 4 0.95,1.3; 5 -0.95,1.3
VQFN20 = smd 1.6 x 1.6: GND 0,0 | smd 0.65 x 0.2: P1 -1.525,0.9; P2 -1.525,0.45; P3 -1.525,0; P4 -1.525,-0.45; P5 -1.525,-0.9; P11 1.525,-0.9; P12 1.525,-0.45; P13 1.525,0; P14 1.525,0.45; P15 1.525,0.9 | smd 0.2 x 0.65: P6 -0.9,-1.525; P7 -0.45,-1.525; P8 0,-1.525; P9 0.45,-1.525; P10 0.9,-1.525; P16 0.9,1.525; P17 0.45,1.525; P18 0,1.525; P19 -0.45,1.525; P20 -0.9,1.525
KPA-2106SECK = smd 1.5 x 0.8: P$1 0,0; P$2 2.6,0
VEML6075 = smd 0.9 x 0.35: P$1 0.05,0; P$2 0.05,-0.7; P$4 1.95,0 | smd 1 x 0.35: P$3 1.9,-0.7
STC3100 = smd 1.213 x 0.406: CG 4.1,0.65; GND 4.1,0; IO -0.1,1.95; ROSC -0.1,1.3; SCL -0.1,0; SDA -0.1,0.65; VCC 4.1,1.3; VIN 4.1,1.95
SHARP27 = smd 1.8 x 0.25: 1 -3.12,-2.21; 2 -3.12,-1.71; 3 -3.12,-1.21; 4 -3.12,-0.71; 5 -3.12,-0.21; 6 -3.12,0.29; 7 -3.12,0.79; 8 -3.12,1.29; 9 -3.12,1.79; 10 -3.12,2.29 | smd 1.5 x 1.5: P$8 0.425,3.79; P$9 0.425,-3.71
QFN48 = smd 1 x 0.226: 1 -3.02,2.2; 2 -3.02,1.8; 3 -3.02,1.4; 4 -3.02,1; 5 -3.02,0.6; 6 -3.02,0.2; 7 -3.02,-0.2; 8 -3.02,-0.6; 9 -3.02,-1; 10 -3.02,-1.4; 11 -3.02,-1.8; 12 -3.02,-2.2; 25 3.02,-2.2; 26 3.02,-1.8; 27 3.02,-1.4; 28 3.02,-1; 29 3.02,-0.6; 30 3.02,-0.2; 31 3.02,0.2; 32 3.02,0.6; 33 3.02,1; 34 3.02,1.4; 35 3.02,1.8; 36 3.02,2.2 | smd 0.226 x 1: 13 -2.2,-3.02; 14 -1.8,-3.02; 15 -1.4,-3.02; 16 -1,-3.02; 17 -0.6,-3.02; 18 -0.2,-3.02; 19 0.2,-3.02; 20 0.6,-3.02; 21 1,-3.02; 22 1.4,-3.02; 23 1.8,-3.02; 24 2.2,-3.02; 37 2.2,3.02; 38 1.8,3.02; 39 1.4,3.02; 40 1,3.02; 41 0.6,3.02; 42 0.2,3.02; 43 -0.2,3.02; 44 -0.6,3.02; 45 -1,3.02; 46 -1.4,3.02; 47 -1.8,3.02; 48 -2.2,3.02 | smd 4.6 x 4.6: GND 0,0
CRYSTAL-SMD-3.2X1.5MM = smd 1 x 1.8: P$1 -1.25,0; P$2 1.25,0
CRYSTAL-SMD-5X3.2-4PAD = smd 1.9 x 1.1: 1 -1.85,-1.15; 2 1.85,-1.15; 3 1.85,1.15; 4 -1.85,1.15

### Placement (x,y rotation side)
C1  16.38,47.24 270 bottom
C2  28.07,20.32 90 bottom
C3  21.72,67.95 180 bottom
C4  20.45,19.69 270 bottom
C5  21.72,70.74 0 bottom
C6  8.64,73.28 180 bottom
C7  18.54,22.48 270 bottom
C8  5.59,74.93 180 bottom
C9  9.4,59.56 270 bottom
C10  25.02,25.91 0 bottom
C11  6.35,57.02 180 bottom
C12  35.18,73.15 90 bottom
C13  44.7,73.91 90 bottom
C14  26.67,67.82 180 bottom
C15  24,44.96 90 bottom
C16  29.34,46.99 90 bottom
C17  37.08,45.85 0 bottom
C18  26.8,46.1 0 bottom
C19  36.2,48.51 90 bottom
C20  25.78,50.16 180 bottom
C21  25.78,52.32 180 bottom
C22  24,34.54 270 bottom
C23  27.94,31.12 0 bottom
C24  31.75,30.73 270 bottom
C25  34.67,29.84 270 bottom
C26  40.01,29.72 270 bottom
C27  24.77,47.88 180 bottom
C28  25.02,27.94 0 bottom
C29  27.05,37.59 180 bottom
C30  22.86,58.29 270 bottom
D1  3.56,68.07 90 bottom
D2  14.61,61.59 0 bottom
D3  6.6,53.72 0 bottom
E1  41.02,30.73 90 bottom
FB1  26.8,43.56 0 bottom
FB2  37.34,30.48 0 bottom
IC1  8.76,69.47 0 bottom
J1  2.92,27.56 90 top
J4  2.16,64.01 0 top
J5  3.05,34.04 90 top
J6  2.92,23.37 270 top
J7  43.05,68.96 180 top
L1  22.35,78.99 180 top
LED1  44.07,60.2 0 bottom
MBAT  14.61,70.74 270 bottom
MS5637  41.67,74.31 0 bottom
P3  28.96,54.61 180 bottom
P4  30.23,56.77 0 bottom
P5  31.75,54.61 180 bottom
P13  38.48,48.51 0 bottom
Q1  26.42,73.53 90 bottom
R1  15.24,67.69 270 bottom
R2  19.43,73.53 90 bottom
R3  31.75,16 180 bottom
R4  29.21,73.66 90 bottom
R5  12.59,49.68 90 bottom
R6  15.49,44.7 0 bottom
R7  14.61,47.24 270 bottom
R8  3.17,60.33 90 bottom
R9  11.68,54.48 270 bottom
R10  9.4,56.13 90 bottom
R11  18.54,18.92 90 bottom
R12  44.07,54.74 270 bottom
R13  11.56,59.56 90 bottom
R14  24.38,73.53 270 bottom
R15  26.67,70.36 180 bottom
R16  30.35,18.67 90 bottom
R17  22.48,17.27 0 bottom
R18  11.68,72.26 270 bottom
R19  14.61,73.66 0 bottom
R20  19.43,59.56 0 bottom
R21  34.54,54.36 90 bottom
R22  35.31,65.53 0 bottom
R23  35.31,62.23 0 bottom
R24  25.91,54.23 180 bottom
R25  25.65,61.21 180 bottom
RX  38.1,43.69 0 bottom
S1  39.5,6.73 0 top
S2  23.11,6.73 90 top
S3  6.73,6.73 0 top
SPK1  22.61,55.88 270 bottom
SWDCLK  35.94,33.53 90 bottom
SWDIO  34.67,35.69 180 bottom
T1  6.48,60.45 90 bottom
T2  15.11,56.13 90 bottom
T3  34.16,18.03 180 bottom
T4  31.62,73.15 0 bottom
T5  25.65,58.04 0 bottom
U1  10.41,63.5 180 bottom
U2  23.75,22.48 180 bottom
U$1  13.46,12.19 0 top
U$2  26.92,79.38 0 top
U$3  16.89,66.8 90 bottom
U$4  8.57,44.92 0 bottom
U$5  0,76.33 270 top
U$6  33.02,40.89 270 bottom
U$7  30.1,12.19 0 top
U$8  29.21,77.34 180 top
VBAT  2.29,74.93 270 bottom
Y1  28.7,50.67 270 bottom
Y2  28.19,34.42 180 bottom

### Tracks (layer width: path | path; a pad name or v marks a point on that pad's centre or on a via)
5150_CS  (via drill 0.36)
  Top 0.178: v22.99,41.53 17.65,41.53 14.73,44.45 5.08,44.45 4.19,45.34 4.19,59.44 2.16,61.47 J4.1
  Bottom 0.178: U$6.40 26.91,39.89 26.42,40.39 24.13,40.39 v22.99,41.53
AT42_COUT  (via drill 0.36)
  Top 0.152: v37.85,36.07 37.85,35.69 37.85,35.43 37.85,24.26 v37.72,24.13 37.72,24 37.72,20.83 37.47,20.57 v9.65,20.57
  Bottom 0.152: U2.P12 36.65,22.93 v37.72,24.13 | 36.06,39.88 U$6.21 36.06,39.88 | v37.85,36.07 38.35,36.58 38.35,37.08 38.35,39.37 37.85,39.88 36.06,39.88 | D3.2 4.87,52.62 3.17,50.93 3.17,40.01 1.14,37.97 1.14,19.43 1.91,18.67 7.75,18.67 v9.65,20.57
AT42_DOUT  (via drill 0.36)
  Top 0.178: v38.73,23.11 38.73,23.24 38.73,24 38.73,40.13 v38.61,40.26
  Bottom 0.178: U2.P13 38.1,22.48 v38.73,23.11 | v38.61,40.26 37.34,40.26 37.21,40.26 36.08,40.26 U$6.20
AT42_GOUT  (via drill 0.36)
  Top 0.178: v36.7,24.64 36.7,36.83 v37.47,37.59
  Bottom 0.178: U2.P11 35.57,23.38 v36.7,24.64 | v37.47,37.59 37.47,39.12 37.08,39.5 U$6.22
CHRG_END
  Bottom 0.178: IC1.1 10.19,68.17 14.1,64.26 16.64,64.26 17.65,63.25 17.91,62.99 27.81,62.99 32.89,57.91 33.02,57.79 33.02,51.31 33.62,50.71 U$6.8
CPAD  (via drill 0.36)
  Top 0.178: v25.02,15.75 25.02,6.6 S2.P$1
  Bottom 0.178: R17.1 v25.02,15.75
DISP
  Bottom 0.178: U$4.5 13.34,44.71 13.59,44.96 13.59,45.59 13.97,45.97 14.19,45.97 R7.2 C1.2
DPAD  (via drill 0.36)
  Top 0.178: S1.P$1 39.5,16.26 37.97,17.78 v31.62,17.78
  Bottom 0.178: v31.62,17.78 30.39,17.78 R16.1
EXTCOMM
  Bottom 0.178: R6.2 13.97,44.7 13.46,44.2 11.7,44.2 U$4.4
EXTMODE
  Bottom 0.152: R5.1 12.26,48.57 13.08,47.75 13.08,46.61 12.7,46.23 11.71,46.23 U$4.8
GND  (via drill 0.36)
  Top 0.203: L1.3-GND 24.8,76.11 v24.64,75.95
  Top 0.254: U$2.P$1 26.97,81.08 v27.05,81.15
  Top 0.305: v13.34,56.39 18.92,56.39 v19.05,56.52 | v13.34,66.93 13.34,64.77 17.02,61.09 v18.29,61.09
  Top 0.356: v16.64,51.56 v19.56,51.56 | v21.59,61.85 v21.59,65.41 | v38.23,62.1 v38.23,65.53 | v32,60.33 v29.08,60.33 | v39.5,51.05 v39.5,53.98
  Bottom 0.152: 23.11,12.73 23.11,12.7 | 23.11,12.7 23.11,6.73 23.11,12.7
  Bottom 0.178: S1.GND 39.62,15.49 | U$6.GND 32.82,40.69 arc-90 U$6.GND | U$6.GND 32.02,41.89 U$6.45 29.98,41.91 29.97,41.91 | R13.1 11.56,57.79 | U2.P8 U2.GND | 29.97,41.91 30.1,41.91 29.97,41.91 | 29.97,41.91 25.02,41.91 24.77,42.16 | U$6.31 32.82,30.85 | 6.73,12.45 S3.GND 6.73,12.45
  Bottom 0.203: v24.64,75.95 24.26,75.95 24,76.2 24,76.84
  Bottom 0.229: C25.2 arc-90 32.82,30.85 32.82,40.69
  Bottom 0.254: v27.05,81.15 26.54,81.15 26.42,81.28
  Bottom 0.508: 39.62,12.45 39.62,15.49 | S3.GND 6.73,16 | 22.99,12.31 23.11,12.7 23.11,15.49
  Bottom 0.61: 20.7,75.44 20.7,77.09 | 30.48,75.56 30.48,75.82 29.21,77.09
  other vias: 21.97,80.64 22.73,79.76 21.46,77.98
  pour Bottom (isolate 0.254, rank 2, no thermals): 0.64,75.95 45.72,75.95 45.72,14.73 0.64,14.73
  pour Top (no thermals): 19.3,80.9 20.07,81.66 29.21,81.66 29.97,80.9 29.97,76.84 29.72,76.58 19.43,76.58 19.3,76.71
  pour Bottom (no thermals): 19.18,81.03 19.94,81.66 29.08,81.66 29.97,80.9 29.97,76.84 29.72,76.58 19.43,76.58 19.18,76.84
GPAD  (via drill 0.36)
  Top 0.178: S3.P$1 6.73,13.46 v10.29,17.02
  Bottom 0.178: v10.29,17.02 17.49,17.02 R11.1
LDO_VIN  (via drill 0.36)
  Top 0.305: v9.4,66.29 7.24,66.29 v6.35,67.18
  Bottom 0.305: U1.1 9.46,66.23 v9.4,66.29 | v6.35,67.18 5.54,67.18 D1.3
LED_BCK  (via drill 0.36)
  Top 0.178: v34.54,67.82 34.54,56.9 | 34.54,56.9 v34.54,56.01 | v34.54,56.01 34.54,52.58 39.62,47.5 39.62,25.53 v39.62,24.38 | v34.54,56.01 34.54,56.9
  Bottom 0.178: T4.1 32.57,69.79 v34.54,67.82 | T3.1 33.15,19.3 33.15,19.69 34.54,21.08 35.31,21.84 38.86,21.84 39.62,22.61 39.62,22.99 v39.62,24.38 | R21.2 v34.54,56.01
LED_PIN
  Bottom 0.178: U$6.17 38.7,41.49 40.01,42.8 40.01,49.28 40.64,49.91 42.55,49.91 44.07,51.44 R12.2
MBAT
  Bottom 0.178: 15.46,71.72 15.75,72.01 17.4,72.01 17.53,71.88 17.53,70.92 U$3.CG
  Bottom 0.254: R19.1 15.46,71.59 | 15.46,71.59 MBAT.P$1 | 15.46,71.59 15.46,71.72
N$1
  Bottom 0.178: R9.2 12.46,53.63 T2.1
N$2
  Bottom 0.305: R12.1 LED1.A
N$3
  Bottom 0.178: U2.P15 27.66,21.58 C2.2 29.38,21.17 30.35,20.19 R16.2
N$4
  Bottom 0.178: U2.P16 24.65,19.93 25.15,19.43 28.03,19.43 C2.1
N$5
  Bottom 0.178: U2.P2 21.65,22.03 21.46,21.84 21.46,19.6 C4.2 20.7,18.2 R17.2
N$6
  Bottom 0.178: R11.2 C7.2 18.76,21.84 20.19,21.84 21.28,22.93 U2.P4
N$7
  Bottom 0.178: C7.1 21.42,23.33 21.46,23.37 U2.P5
N$8
  Bottom 0.178: R8.1 3.2,59.5 T1.1 5.38,57.15 C11.1 5.5,55.93 D3.3
N$9
  Bottom 0.178: U2.P3 21.46,22.48 20.45,21.46 C4.1
N$10
  Bottom 0.178: R25.2 26.5,59.99 T5.3 C30.1
N$11  (via drill 0.36)
  Top 0.178: U$8.P$2 26.61,76.64 27.3,75.95 v28.7,75.95
  Bottom 0.178: v28.7,75.95 29.08,75.95 29.46,75.56 29.46,74.76 R4.2
N$12
  Bottom 0.178: C5.2 20.45,70.9 U$3.VIN 18.84,72.09 R2.1
N$13  (via drill 0.36)
  Top 0.178: v28.57,13.84 28.57,15.37 29.21,16 v29.84,16
  Top 0.254: U$1.P$1 13.46,11.3 13.97,10.79 16.64,10.79 19.68,13.84 v24.13,13.84 | U$7.P$1 30.1,12.32 v28.57,13.84
  Bottom 0.178: v29.84,16 R3.1
  Bottom 0.254: v24.13,13.84 27.81,13.84 | 27.81,13.84 v28.57,13.84 27.81,13.84
N$14
  Bottom 0.178: IC1.5 11.04,70.77 R18.2
N$15
  Bottom 0.178: U$6.33 32.02,32.11 C24.1
N$16
  Bottom 0.178: R1.1 15.28,68.75 15.75,68.83 16.26,68.83 16.38,68.83 17.78,68.83 18.16,68.45 18.16,66.73 U$3.ROSC
N$17
  Bottom 0.178: C15.1 24.55,43.56 FB1.2 25.85,43.37 26.8,42.42 28.19,42.42 28.32,42.29 U$6.46
N$18
  Bottom 0.229: U$6.30 33.22,32.15 arc90 C25.1 36.17,30.7 arc-90 FB2.2
N$19
  Bottom 0.178: U$6.47 28.61,42.69 FB1.1
N$20
  Bottom 0.178: C16.1 29.34,45.97 30.73,44.58 30.73,44 U$6.1
N$21
  Bottom 0.229: FB2.1 39.92,30.48 arc90 C26.1 40.6,30.57 arc90 E1.ANT
N$22  (via drill 0.36)
  Top 0.178: U$8.P$1 29.21,76.84 30.1,75.95 31.5,75.95 v31.62,75.82
  Bottom 0.178: v31.62,75.82 T4.3
N$23
  Bottom 0.254: T3.3 34.17,16.05 R3.2
N$24
  Bottom 0.178: C20.2 27.5,49.42 Y1.P$2 30.59,49.42 31.11,48.9 31.24,48.77 31.24,43.94 U$6.2
N$25
  Bottom 0.178: C21.2 27.03,51.94 Y1.P$1 28.94,51.56 29.21,51.69 31.62,49.28 U$6.3
N$26
  pour Bottom (isolate 0.254, no thermals): 32.64,37.21 32.77,29.97 34.16,28.58 35.18,28.58 35.31,28.7 35.31,31.24 35.18,31.37 33.78,31.37 33.53,31.62 33.53,37.21
N$27
  Bottom 0.178: C22.1 26.17,35.39 Y2.1 26.93,35.57 27.94,36.58 30.73,36.58 31.24,37.08 31.24,37.85 U$6.35
N$28
  Bottom 0.178: U$6.34 31.62,34.67 30.22,33.27 Y2.3 30.04,32.37 C23.1
N$29
  Bottom 0.178: C30.2 21.97,56.55 21.97,55.92 SPK1.P$1
N$30
  Bottom 0.178: R24.1 25.06,55.39 T5.1
NEO_DIN  (via drill 0.36)
  Top 0.178: v26.04,80.26 25.18,80.26 L1.4-DIN
  Bottom 0.178: 26.33,74.38 R14.1 26.33,74.38 | 26.33,74.38 Q1.3 26.42,79.88 v26.04,80.26
NEO_PIN  (via drill 0.36)
  Top 0.178: v25.53,69.47 25.53,65.91 30.23,61.21 32.38,61.21 v33.4,60.2
  Bottom 0.178: Q1.2 25.76,70.42 R15.1 25.53,70.36 v25.53,69.47 | v33.4,60.2 33.4,51.56 34.04,50.93 34.04,43.93 U$6.9
P2
  Bottom 0.178: U$6.4 32,43.93 32,49.78 30.73,51.05 30.73,51.94 29.46,53.21 28.07,53.21 27.77,53.21 R24.2
P3
  Bottom 0.178: P3.P$1 28.96,54.48 31.24,52.2 31.24,51.18 32.38,50.04 32.38,43.95 U$6.5
P4
  Bottom 0.178: U$6.6 32.82,50.24 31.75,51.31 31.75,52.32 30.35,53.72 30.35,56.64 P4.P$1
P5
  Bottom 0.178: U$6.7 33.22,50.47 32.26,51.44 32.26,54.1 P5.P$1
P13
  Bottom 0.178: U$6.16 38.47,41.89 39.62,43.05 39.62,47.37 P13.P$1
PIN_BCK
  Bottom 0.178: R21.1 34.54,51.56 34.42,51.44 U$6.10
RX
  Bottom 0.178: U$6.15 36.71,42.29 RX.P$1
SCL  (via drill 0.36)
  Top 0.178: v40.51,63.25 J7.2 | v17.27,64.77 18.29,65.79 18.29,72.9 20.7,75.31 20.95,75.56 23.62,78.23 28.38,78.23 U$2.P$3
  Bottom 0.178: U$3.SCL 16.89,65.15 17.02,65.02 | 17.02,65.02 v17.27,64.77 | v17.27,64.77 18.67,63.37 33.15,63.37 | 33.15,63.37 40.39,63.37 v40.51,63.25 41.53,63.25 41.91,62.87 41.91,53.59 41.02,52.7 36.2,52.7 34.82,51.33 U$6.11 | MS5637.SCL 40.67,69.12 J7.2 | v17.27,64.77 17.02,65.02 | R23.2 33.66,62.23 33.15,62.74 33.15,63.37
SDA  (via drill 0.36)
  Top 0.178: v17.53,68.07 17.53,72.77 20.7,75.95 23.5,78.74 26.91,78.74 U$2.P$2
  Bottom 0.178: 33.27,64.39 18.8,64.39 17.54,65.64 U$3.SDA 17.54,67.68 v17.53,68.07 | 33.27,64.39 42.16,64.39 | 42.16,64.39 43.05,65.28 J7.1 42.67,69.34 MS5637.SDA | U$6.12 35.22,50.97 36.45,52.2 41.27,52.2 42.29,53.21 42.29,64.26 42.16,64.39 | R22.2 33.66,65.53 33.27,65.15 33.27,64.39
SELF_EN
  Bottom 0.178: R10.1 9.45,55.33 R9.1 12.45,56.09 12.45,57.4 13.08,58.04 16.38,58.04 18.03,56.39 18.03,43.43 19.3,42.16 23.5,42.16 24.26,41.4 27.43,41.4 28.14,40.69 U$6.42
SHARP_CS  (via drill 0.36)
  Top 0.178: v15.62,42.04 16.26,42.04 17.53,40.77 27.05,40.77 v27.18,40.64
  Bottom 0.178: v15.62,42.04 13.95,43.71 11.78,43.71 | v27.18,40.64 27.56,40.26 29.96,40.26 U$6.41 | 11.67,43.69 U$4.3 11.78,43.71 | J5.2 3.05,37.72 4.32,38.99 4.32,42.04 5.97,43.69 11.76,43.69 11.78,43.71
SPIM_DIN  (via drill 0.36)
  Top 0.152: v21.21,39.62 8.13,39.62 v8,39.5
  Bottom 0.152: U$6.38 26.06,39.09 25.53,39.62 23.62,39.62 23.11,39.12 21.72,39.12 v21.21,39.62 | v8,39.5 7.75,39.5 5.97,37.72 5.97,23.88 J6.2
SPIM_DO  (via drill 0.36)
  Top 0.178: v16.26,40.26 22.23,40.26 v22.48,40.01
  Bottom 0.178: v16.26,40.26 13.31,43.21 U$4.2 6.5,43.21 4.95,41.66 4.95,38.99 4.95,38.1 4.95,35.43 4.06,34.54 3.56,34.54 J5.1 | v22.48,40.01 26.16,40.01 26.67,39.5 U$6.39
SPIM_SCK  (via drill 0.36)
  Top 0.178: v16.76,38.73 v24.64,38.73
  Bottom 0.178: v16.76,38.73 12.79,42.71 U$4.1 11.66,42.67 6.99,42.67 5.59,41.27 5.59,38.23 5.59,26.03 J6.1 | v24.64,38.73 29.96,38.73 U$6.37
SW_AT  (via drill 0.36)
  Top 0.178: v23.37,72.26 23.37,59.31 21.97,57.91 14.86,57.91 v13.72,59.05 | L1.1-VDD 19.9,79.41 v20.19,79.12
  Bottom 0.178: R14.2 23.96,72.26 v23.37,72.26 23.24,72.39 23.24,77.34 21.46,79.12 v20.19,79.12 | T1.3 7.62,60.41 C9.1 R13.2 11.64,60.5 D2.2 13.72,60.43 v13.72,59.05
SW_POWER  (via drill 0.36)
  Top 0.178: v20.83,67.06 17.4,63.12 v16.76,63.12 17.91,61.98 v19.68,61.98
  Bottom 0.178: 20.45,68.07 20.45,69.47 20.19,69.72 18.54,69.72 18.19,70.07 U$3.VCC 18.19,73.69 18.8,74.3 19.34,74.3 R2.2 | 20.45,68.07 20.45,67.98 C3.1 20.45,68.07 | U1.3 12.5,64.8 D2.3 14.61,62.74 14.61,63.12 v16.76,63.12 | v20.83,67.06 20.83,67.95 20.45,68.07 | R20.1 20.28,61.38 v19.68,61.98
SWDCLK
  Bottom 0.178: SWDCLK.P$1 35.31,33.15 36.58,34.42 36.58,35.81 35.69,36.7 35.31,37.08 35.31,37.79 U$6.25
SWDIO
  Bottom 0.178: U$6.26 34.82,35.41 SWDIO.P$1
TRANS
  Bottom 0.178: D3.1 14.01,52.62 16.26,54.86 16.26,56.09 T2.3
VBAT  (via drill 0.35, 0.36)
  Top 0.178: v13.97,40.51 10.54,43.94 4.32,43.94 3.56,44.7 3.56,54.86 1.91,56.52 v1.91,57.4 | v16,34.54 v22.61,27.94
  Bottom 0.178: U2.P9 24.2,25.88 C10.2 C28.2 24.13,27.94 22.99,27.94 | 5.52,61.4 T1.2 5.15,61.18 R8.2 3.17,61.09 | 3.17,61.09 3.17,60.71 | v13.97,40.51 14.35,40.51 16,38.86 v16,34.54 | 22.99,27.94 v22.61,27.94 22.99,27.94 | v1.91,57.4 1.91,60.58 2.41,61.09 3.17,61.09
  Bottom 0.229: 3.12,61.24 R8.2 | C8.1 4.74,70.45 6.99,68.2 7.78,68.2 IC1.3
  Bottom 0.254: IC1.3 7.81,66.45
  Bottom 0.305: 5.52,61.4 6.6,62.48 6.99,62.87 6.99,64.1 6.99,64.52 | 6.99,64.52 6.99,64.9 5.84,66.04 3.54,66.04 D1.1 | 7.81,66.45 7.81,65.34 6.99,64.52
  Bottom 0.508: VBAT.P$1 C8.1
VCC  (via drill 0.36)
  Top 0.178: v28.32,80.39 28.7,80.39 28.96,80.14 28.96,79.46 U$2.P$4
  Top 0.254: U$1.P$2 16.06,15.43 16.13,15.49 | U$7.P$2 32.7,15.43 32.64,15.49
  Bottom 0.152: 44.54,75.31 v43.69,75.31
  Bottom 0.178: U$4.6 U$4.7 12.81,45.71 13.59,46.48 13.59,47.62 13.97,48.01 14.52,48.01 R7.1 v14.61,49.15 | 27.52,68.71 R15.2 27.52,72.15 Q1.1 | 27.52,68.71 C14.2 | MS5637.VDD v43.69,75.31 44.54,75.31 C13.2 | v27.43,69.09 27.43,68.8 27.52,68.71 | v28.83,37.59 C29.2 v28.83,37.59 | v28.83,37.59 30.54,37.59 U$6.36 | C17.2 36.23,43.29 U$6.13 | C17.2 36.23,46.48 36.23,47.62 C19.1 | C27.2 25.87,47.88 C18.1 27.65,45.59 | 27.65,45.59 27.65,45.25 27.94,44.96 28.83,44.96 29.21,44.58 29.21,43.31 29.46,43.05 29.96,43.05 U$6.48 | v27.69,45.09 27.69,45.63 27.65,45.59 | v29.21,71.88 R4.1 28.79,72.81 28.19,73.41 28.19,74.8 27.81,75.18 27.81,79.88 v28.32,80.39 | v35.18,75.06 C12.2 | v8.64,62.1 9.37,62.1 U1.5 | v36.2,61.09 36.2,62.19 R23.1 | v36.2,66.67 36.2,65.57 R22.1 | C17.2 36.23,44.74 v36.2,44.7 | R25.1 24.42,60.92 v24.38,60.2
  pour Top (isolate 0.279, rank 2, no thermals): 0.76,75.82 45.21,75.82 45.09,14.73 0.64,14.73
VUSB  (via drill 0.36)
  Top 0.305: v6.86,70.87 5.33,70.87 4.7,70.23 | 4.7,70.23 J4.2 12.06,64.01 v16.51,59.56 | 4.7,70.23 2.54,70.23 v2.41,70.1
  Bottom 0.178: 7.79,70.8 IC1.4 | v16.51,59.56 15.62,60.43 D2.1
  Bottom 0.254: C6.1 7.79,70.8
  Bottom 0.305: IC1.4 6.96,70.77 v6.86,70.87 | v2.41,70.1 2.41,69.06 D1.2